# Altium schematic sheet Com_Canbus.SchDoc
size A3; CompanyName: Ok's Lab; Engineer: Oktay Topcu; SheetNumber: 4; SheetTotal: 7; UniqueID: 20200803; X2: A3; X3: 20200803; X4: r1.0; X6: 4; X7: 7; X8: Com_Canbus.SchDoc
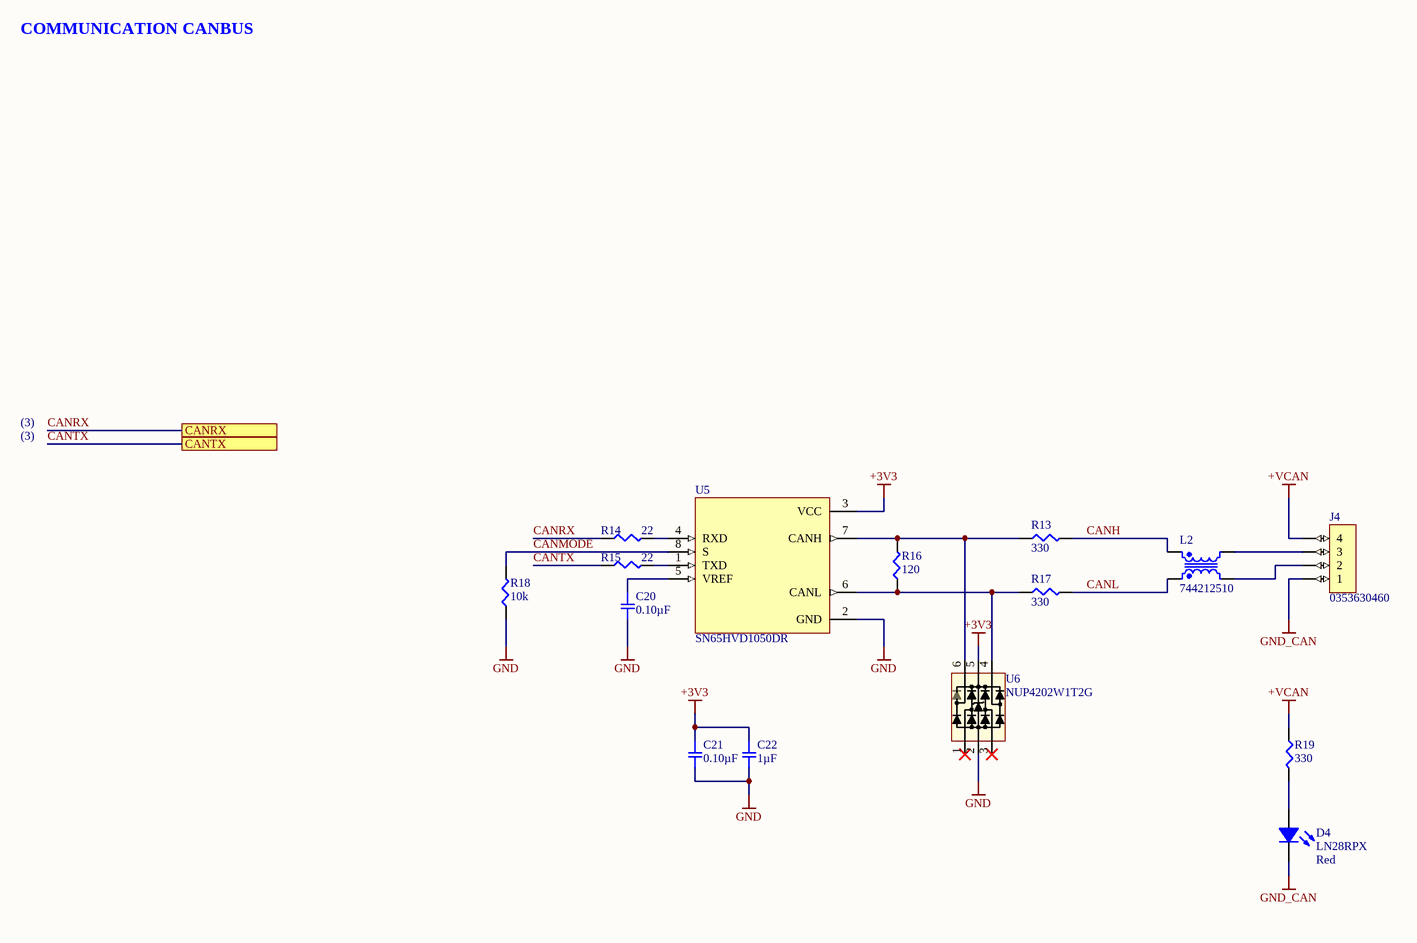
[diagram p0: Com_Canbus.SchDoc]

## Parts
C20  0.10µF  [SMD-0603C]
C21  0.10µF  [SMD-0603C]
C22  1µF  [SMD-0603C]
D4  LN28RPX  Lens Color: Red  [Led-3mm-Red-h7]
J4  0353630460  [CONN_4_POS__0353630460]
L2  744212510  [CM_6.50mm x 3.60mm]
R13  330  [SMD-0603-RES]
R14  22  [SMD-0603-RES]
R15  22  [SMD-0603-RES]
R16  120  [SMD-0603-RES]
R17  330  [SMD-0603-RES]
R18  10k  [SMD-0603-RES]
R19  330  [SMD-0603-RES]
U5  SN65HVD1050DR  [SOIC-8_L]
U6  NUP4202W1T2G  [SOT-363]

## Ports
CANRX, CANTX

## Nets
+3V3: C21.1 C22.1 U5.3(VCC) U6.5
+VCAN: J4.4 R19.1
GND: C20.2 C21.2 C22.2 R18.1 U5.2(GND) U6.2
GND_CAN: D4.2(K) J4.1
CANH: L2.3 R13.2
CANL: L2.1 R17.2
CANMODE: R18.2 U5.8(S)
CANRX: R14.1 ; port CANRX
CANTX: R15.1 ; port CANTX
NetC20_1: C20.1 U5.5(VREF)
NetD4_1: D4.1(A) R19.2
NetJ4_2: J4.2 L2.5
NetJ4_3: J4.3 L2.4
NetR13_1: R13.1 R16.2 U5.7(CANH) U6.6
NetR14_2: R14.2 U5.4(RXD)
NetR15_2: R15.2 U5.1(TXD)
NetR16_1: R16.1 R17.1 U5.6(CANL) U6.4

Not connected (* = marked no-connect by the designer): U6 1* 3*

## Notes on the sheet
- COMMUNICATION CANBUS
- (3)
- Title
- Size:
- Date:
- Number:
- Revision:
- Sheet
- of
- File:

## Library data of the parts
C20 C21 = GCJ188R71H104KA12D: CAP CER 0.1UF 50V X7R 0603; Manufacturer: Murata Electronics North America; Factory Stock: 0; Unit Price (USD): 0.12; Minimum Quantity: 1; Tolerance: ±10%; Datasheets: http://www.murata.com/~/media/webrenewal/support/library/catalog/products/capacitor/mlcc/c03e.ashx; Image: //media.digikey.com/Renders/Murata%20Renders/0603%28LQG18%29.jpg; Digi-Key Part Number: 490-5798-1-ND; Part Number: GCJ188R71H104KA12D; Quantity Available: 163695; @ qty: 0; Packaging: Cut Tape (CT); Series: GCJ; Part Status: Active; Value: 0.10µF; Voltage: 50V; Temperature Coefficient: X7R; Operating Temperature: -55°C ~ 125°C; Features: Soft Termination; Ratings: AEC-Q200; Applications: Automotive, Boardflex Sensitive; Mounting Type: Surface Mount, MLCC; Package / Case: 0603 (1608 Metric); Size / Dimension: 0.063" L x 0.031" W (1.60mm x 0.80mm); Height - Seated (Max): -; Thickness (Max): 0.035" (0.90mm); Lead Spacing: -; Lead Style: -
C22 = GCM188R71C105KA64D: CAP CER 1UF 16V X7R 0603; Manufacturer: Murata Electronics North America; Factory Stock: 0; Unit Price (USD): 0.24; Minimum Quantity: 1; Tolerance: ±10%; Datasheets: http://www.murata.com/~/media/webrenewal/support/library/catalog/products/capacitor/mlcc/c03e.ashx; Image: //media.digikey.com/Renders/Murata%20Renders/0603%28GCM188%29.jpg; Digi-Key Part Number: 490-5241-1-ND; Part Number: GCM188R71C105KA64D; Quantity Available: 9243; @ qty: 0; Packaging: Cut Tape (CT); Series: GCM; Part Status: Active; Value: 1µF; Voltage: 16V; Temperature Coefficient: X7R; Operating Temperature: -55°C ~ 125°C; Features: -; Ratings: AEC-Q200; Applications: Automotive; Mounting Type: Surface Mount, MLCC; Package / Case: 0603 (1608 Metric); Size / Dimension: 0.063" L x 0.031" W (1.60mm x 0.80mm); Height - Seated (Max): -; Thickness (Max): 0.035" (0.90mm); Lead Spacing: -; Lead Style: -
D4 = LED_RED__LN28RPX: LED RED DIFF 3MM ROUND T/H; Manufacturer: Panasonic Electronic Components; Lens Transparency: Diffused; Millicandela Rating: 2.8mcd; Lens Style/Size: Round with Domed Top, 3mm (T-1), 3.00mm; Voltage - Forward (Vf) (Typ): 2.2V; Current - Test: 15mA; Wavelength - Peak: 700nm; Manufacturer Part Number: LN28RPX; Category: Optoelectronics; Supplier: Digi-Key; RoHS: RoHS Compliant; Packaging: Bulk; Part Status: Not For New Designs; Color: Red; Viewing Angle: -; Mounting Type: Through Hole; Wavelength - Dominant: -; Features: -; Package / Case: Radial; Supplier Device Package: 3mm Round; Size / Dimension: -; Height (Max): 5.70mm; ComponentLink1URL: http://industrial.panasonic.com/www-cgi/jvcr13pz.cgi?E+SC+4+ATA7001+LN28RPX+8+WW; ComponentLink1Description: http://industrial.panasonic.com/www-cgi/jvcr13pz.cgi?E+SC+4+ATA7001+LN28RPX+8+WW; Pricing: 1=0.45, 10=0.326, 25=0.2664, 100=0.213, 250=0.17972, 500=0.15308, 1000=0.11981, 2500=0.10982, 5000=0.09984 (USD); Supplier Part Number: P563-ND
J4 = CONN_4_POS__0353630460: CONN HEADER 4POS 2MM R/A TIN; Manufacturer: Molex Connector Corporation; Shrouding: Shrouded - 4 Wall; Style: Board to Cable/Wire; Pitch - Mating: 0.079" (2.00mm); Material Flammability Rating: UL94 V-0; Contact Length - Mating: 0.145" (3.70mm); Contact Length - Post: 0.126" (3.20mm); Number of Positions Loaded: All; Number of Positions: 4; Insulation Color: Natural; Insulation Material: Polyamide (PA), Nylon; Contact Finish Thickness - Mating: 78.7µin (2.00µm); Insulation Height: 0.217" (5.51mm); Overall Contact Length: -; Part Status: Active; Current Rating: -; RoHS: RoHS Compliant; Ingress Protection: -; Contact Material: Brass; Contact Finish - Post: Tin; Termination: Kinked Pin, Solder; Mounting Type: Through Hole, Right Angle; Fastening Type: Locking Ramp; Row Spacing - Mating: -; Mated Stacking Heights: -; Features: -; Contact Shape: Square; Contact Type: Male Pin; Packaging: Bulk; Supplier: Digi-Key; Manufacturer Part Number: 0353630460; Category: Connectors, Interconnects; Contact Finish Thickness - Post: 78.7µin (2.00µm); Voltage Rating: -; Operating Temperature: -; Contact Finish - Mating: Tin; Number of Rows: 1; Connector Type: Header; Applications: Automotive, General Purpose; ComponentLink1URL: http://www.molex.com/pdm_docs/sd/353630460_sd.pdf; ComponentLink1Description: http://www.molex.com/pdm_docs/sd/353630460_sd.pdf; Pricing: 1=0.48, 10=0.455, 100=0.3184, 500=0.27294, 1000=0.22745, 5000=0.19496, 10000=0.18196 (USD); Supplier Part Number: WM18933-ND
L2 = CM__744212510: Common Mode Filters / Chokes WE-SL1 SMD Ln Filter 2x51uH 300ohm; Manufacturer: Wurth Electronics; Core Material: Ferrite; Inductance: 51uH; Number of Lines: 2; DC Resistance (DCR): 160mR; Current Rating: 300mA; Test Frequency: 100kHz; Inductance Tolerance: 50%; Voltage Rating (DC): 80V; Impedance: 300R; Supplier 1: Digi-Key; Manufacturer Part Number: 744212510; RoHS: Yes; Category: Fixed Inductors; Pricing 1: 1=4,37000, 10=4,31200, 50=3,89500, 100=3,75600, 500=3,47800 (USD); Mount: Surface Mount; Case/Package: SMD/SMT; Number of Pins: 4; Min Operating Temperature: -40°C; Max Operating Temperature: 105°C; Package Quantity: 1000; Packaging: Tape and Reel; Current: 300mA; Max DC Current: 300mA; Termination: SMD/SMT; Series: WE-SL1; Tolerance: 50%; Length: 6.5mm; Width: 0.142inch; Height: 1.65mm; Depth: 3.6mm; REACH SVHC: No SVHC; Lead Free: Lead Free; RoHS Compliant: Yes; ComponentLink1URL: https://datasheet.ciiva.com/11800/0900766b8059564e-11800467.pdf?src-supplier=RSComponents; ComponentLink1Description: https://datasheet.ciiva.com/11800/0900766b8059564e-11800467.pdf?src-supplier=RSComponents; ComponentLink2URL: https://datasheet.ciiva.com/6048/1735560-6048484.pdf?src-supplier=Farnell; ComponentLink2Description: https://datasheet.ciiva.com/6048/1735560-6048484.pdf?src-supplier=Farnell; ComponentLink3URL: https://datasheet.ciiva.com/1130/744212510-1130407.pdf?src-supplier=Newark; ComponentLink3Description: https://datasheet.ciiva.com/1130/744212510-1130407.pdf?src-supplier=Newark; ComponentLink4URL: https://datasheet.ciiva.com/4952/744212510-77598-4952687.pdf?src-supplier=Mouser; ComponentLink4Description: https://datasheet.ciiva.com/4952/744212510-77598-4952687.pdf?src-supplier=Mouser; ComponentLink5URL: https://datasheet.ciiva.com/7764/1735560-7764951.pdf?src-supplier=Element14; ComponentLink5Description: https://datasheet.ciiva.com/7764/1735560-7764951.pdf?src-supplier=Element14; ComponentLink6URL: https://datasheet.ciiva.com/6216/744212510-6216346.pdf?src-supplier=Digi-Key; ComponentLink6Description: https://datasheet.ciiva.com/6216/744212510-6216346.pdf?src-supplier=Digi-Key; ComponentLink7URL: https://datasheet.ciiva.com/22705/1735560-22705131.pdf?src-supplier=Element14; ComponentLink7Description: https://datasheet.ciiva.com/22705/1735560-22705131.pdf?src-supplier=Element14; ComponentLink8URL: https://datasheet.ciiva.com/6216/744212510-6216348.pdf?src-supplier=Digi-Key; ComponentLink8Description: https://datasheet.ciiva.com/6216/744212510-6216348.pdf?src-supplier=Digi-Key; Supplier Part Number 1: 732-3941-6-ND
R13 R17 R19 = ERJ-3EKF3300V: RES SMD 330 OHM 1% 1/10W 0603; Manufacturer: Panasonic Electronic Components; Factory Stock: 0; Unit Price (USD): 0.00379; @ qty: 1500; Minimum Quantity: 1; Power (Watts): 0.1W, 1/10W; Temperature Coefficient: ±100ppm/°C; Part Number: ERJ-3EKF3300V; Datasheets: http://industrial.panasonic.com/www-cgi/jvcr13pz.cgi?E+PZ+3+AOA0002+ERJ3EKF3300V+7+WW; Image: //media.digikey.com/Photos/Panasonic%20Photos/MFG_ERJ-P6W%20Series.jpg; Digi-Key Part Number: P330HCT-ND; Quantity Available: 670984; Packaging: Cut Tape (CT); Series: ERJ; Part Status: Active; Value: 330; Tolerance: ±1%; Composition: Thick Film; Features: Automotive AEC-Q200; Operating Temperature: -55°C ~ 155°C; Package / Case: 0603 (1608 Metric); Supplier Device Package: 0603; Size / Dimension: 0.063" L x 0.031" W (1.60mm x 0.80mm); Height - Seated (Max): 0.022" (0.55mm); Number of Terminations: 2; Failure Rate: -
R14 R15 = ERJ-3EKF22R0V: RES SMD 22 OHM 1% 1/10W 0603; Manufacturer: Panasonic Electronic Components; Factory Stock: 0; Unit Price (USD): 0.00379; @ qty: 1500; Minimum Quantity: 1; Power (Watts): 0.1W, 1/10W; Temperature Coefficient: ±100ppm/°C; Part Number: ERJ-3EKF22R0V; Datasheets: http://industrial.panasonic.com/www-cgi/jvcr13pz.cgi?E+PZ+3+AOA0002+ERJ3EKF22R0V+7+WW; Image: //media.digikey.com/Photos/Panasonic%20Photos/MFG_ERJ-P6W%20Series.jpg; Digi-Key Part Number: P22.0HCT-ND; Quantity Available: 100321; Packaging: Cut Tape (CT); Series: ERJ; Part Status: Active; Value: 22; Tolerance: ±1%; Composition: Thick Film; Features: Automotive AEC-Q200; Operating Temperature: -55°C ~ 155°C; Package / Case: 0603 (1608 Metric); Supplier Device Package: 0603; Size / Dimension: 0.063" L x 0.031" W (1.60mm x 0.80mm); Height - Seated (Max): 0.022" (0.55mm); Number of Terminations: 2; Failure Rate: -
R16 = ERJ-3EKF1200V: RES SMD 120 OHM 1% 1/10W 0603; Manufacturer: Panasonic Electronic Components; Factory Stock: 0; Unit Price (USD): 0.00379; @ qty: 1500; Minimum Quantity: 1; Power (Watts): 0.1W, 1/10W; Temperature Coefficient: ±100ppm/°C; Part Number: ERJ-3EKF1200V; Datasheets: http://industrial.panasonic.com/www-cgi/jvcr13pz.cgi?E+PZ+3+AOA0002+ERJ3EKF1200V+7+WW; Image: //media.digikey.com/Photos/Panasonic%20Photos/MFG_ERJ-P6W%20Series.jpg; Digi-Key Part Number: P120HCT-ND; Quantity Available: 84623; Packaging: Cut Tape (CT); Series: ERJ; Part Status: Active; Value: 120; Tolerance: ±1%; Composition: Thick Film; Features: Automotive AEC-Q200; Operating Temperature: -55°C ~ 155°C; Package / Case: 0603 (1608 Metric); Supplier Device Package: 0603; Size / Dimension: 0.063" L x 0.031" W (1.60mm x 0.80mm); Height - Seated (Max): 0.022" (0.55mm); Number of Terminations: 2; Failure Rate: -
R18 = ERJ-3EKF1002V: RES SMD 10K OHM 1% 1/10W 0603; Manufacturer: Panasonic Electronic Components; Factory Stock: 0; Unit Price (USD): 0.00379; @ qty: 1500; Minimum Quantity: 1; Power (Watts): 0.1W, 1/10W; Temperature Coefficient: ±100ppm/°C; Part Number: ERJ-3EKF1002V; Datasheets: http://industrial.panasonic.com/www-cgi/jvcr13pz.cgi?E+PZ+3+AOA0002+ERJ3EKF1002V+7+WW; Image: //media.digikey.com/Photos/Panasonic%20Photos/MFG_ERJ-P6W%20Series.jpg; Digi-Key Part Number: P10.0KHCT-ND; Quantity Available: 6703141; Packaging: Cut Tape (CT); Series: ERJ; Part Status: Active; Value: 10k; Tolerance: ±1%; Composition: Thick Film; Features: Automotive AEC-Q200; Operating Temperature: -55°C ~ 155°C; Package / Case: 0603 (1608 Metric); Supplier Device Package: 0603; Size / Dimension: 0.063" L x 0.031" W (1.60mm x 0.80mm); Height - Seated (Max): 0.022" (0.55mm); Number of Terminations: 2; Failure Rate: -
U5 = SN65HVD1050DR: High-Speed CAN Transceiver with Silent Mode 8-SOIC -40 to 125; MF: Texas Instruments; Min Supply Voltage: 4.75V; Max Supply Voltage: 5.25V; Data Rate: 1Mbps; Number of Transceivers: 1; Operating Supply Voltage: 5V; Nominal Supply Current: 70mA; Purchase-URL: https://pricing.snapeda.com/search/part/SN65HVD1050DR/?ref=eda; Digi-Key_Part_Number: 296-26335-1-ND; MP: SN65HVD1050DR; Check_prices: https://www.snapeda.com/parts/SN65HVD1050DR/Texas%20Instruments/view-part/1043210/?ref=eda; SnapEDA_Link: https://www.snapeda.com/parts/SN65HVD1050DR/Texas%20Instruments/view-part/1043210/?ref=snap; Value: *; Package: SOIC-8 Texas Instruments; Supplier 1: Digi-Key; Manufacturer: Texas Instruments; Manufacturer Part Number: SN65HVD1050DR; RoHS: Yes; Category: Interface ICs; Pricing 1: 1=1,69000, 10=1,51300, 25=1,43640, 100=1,18000, 250=1,10304, 500=0,97478, 1000=0,84700 (USD); Case/Package: D; Number of Pins: 8; Weight: 0.002677oz; Contact Plating: Gold; Min Operating Temperature: -40°C; Max Operating Temperature: 125°C; Packaging: Tape and Reel; Package Quantity: 2500; Max Supply Current: 70mA; Number of Drivers: 1; Number of Receivers: 1; Series: -; Supply Current: 70mA; Number of Transmit Buffers: 1; Number of Receive Buffers: 1; Radiation Hardening: No; Lead Free: Lead Free; RoHS Compliant: Yes; REACH SVHC: No SVHC; ComponentLink1URL: https://datasheet.ciiva.com/26828/sn65hvd1050dr-26828644.pdf?src-supplier=IIIC; ComponentLink1Description: https://datasheet.ciiva.com/26828/sn65hvd1050dr-26828644.pdf?src-supplier=IIIC; ComponentLink2URL: https://datasheet.ciiva.com/46392/1888948-46392549.pdf?src-supplier=Element14; ComponentLink2Description: https://datasheet.ciiva.com/46392/1888948-46392549.pdf?src-supplier=Element14; ComponentLink3URL: https://datasheet.ciiva.com/1701/sn65hvd1050-1701693.pdf?src-supplier=Digi-Key; ComponentLink3Description: https://datasheet.ciiva.com/1701/sn65hvd1050-1701693.pdf?src-supplier=Digi-Key; ComponentLink4URL: https://datasheet.ciiva.com/1701/sn65hvd1050-1701694.pdf?src-supplier=Digi-Key; ComponentLink4Description: https://datasheet.ciiva.com/1701/sn65hvd1050-1701694.pdf?src-supplier=Digi-Key; ComponentLink5URL: https://datasheet.ciiva.com/1701/sn65hvd1050-1701695.pdf?src-supplier=Digi-Key; ComponentLink5Description: https://datasheet.ciiva.com/1701/sn65hvd1050-1701695.pdf?src-supplier=Digi-Key; Supplier Part Number 1: 296-26335-6-ND
U6 = NUP4202W1T2G: TVS DIODE 5VWM 14.5VC SOT363; Manufacturer: ON Semiconductor; Capacitance @ Frequency: 3pF @ 1MHz; Voltage - Reverse Standoff (Typ): 5V (Max); Voltage - Breakdown (Min): 6V; Power Line Protection: No; Current - Peak Pulse (10/1000µs): 28A (8/20µs); Power - Peak Pulse: 500W; Voltage - Clamping (Max) @ Ipp: 14.5V (Typ); Type: Steering (Rail to Rail); Operating Temperature: -40°C ~ 125°C (TJ); Supplier: Digi-Key; Applications: General Purpose; Manufacturer Part Number: NUP4202W1T2G; Packaging: Cut Tape (CT); Package / Case: 6-TSSOP, SC-88, SOT-363; Mounting Type: Surface Mount; RoHS: RoHS Compliant; Category: Circuit Protection; Supplier Device Package: SC-88/SC70-6/SOT-363; Part Status: Active; ComponentLink1URL: http://www.onsemi.com/pub_link/Collateral/NUP4202W1-D.PDF; ComponentLink1Description: http://www.onsemi.com/pub_link/Collateral/NUP4202W1-D.PDF; Pricing: 1=0.69, 10=0.595, 100=0.4441, 500=0.34896, 1000=0.26965 (USD); Stock: 8683; Supplier Part Number: NUP4202W1T2GOSCT-ND